# Altium project QUTMS_TSAL_V2.PrjPcb
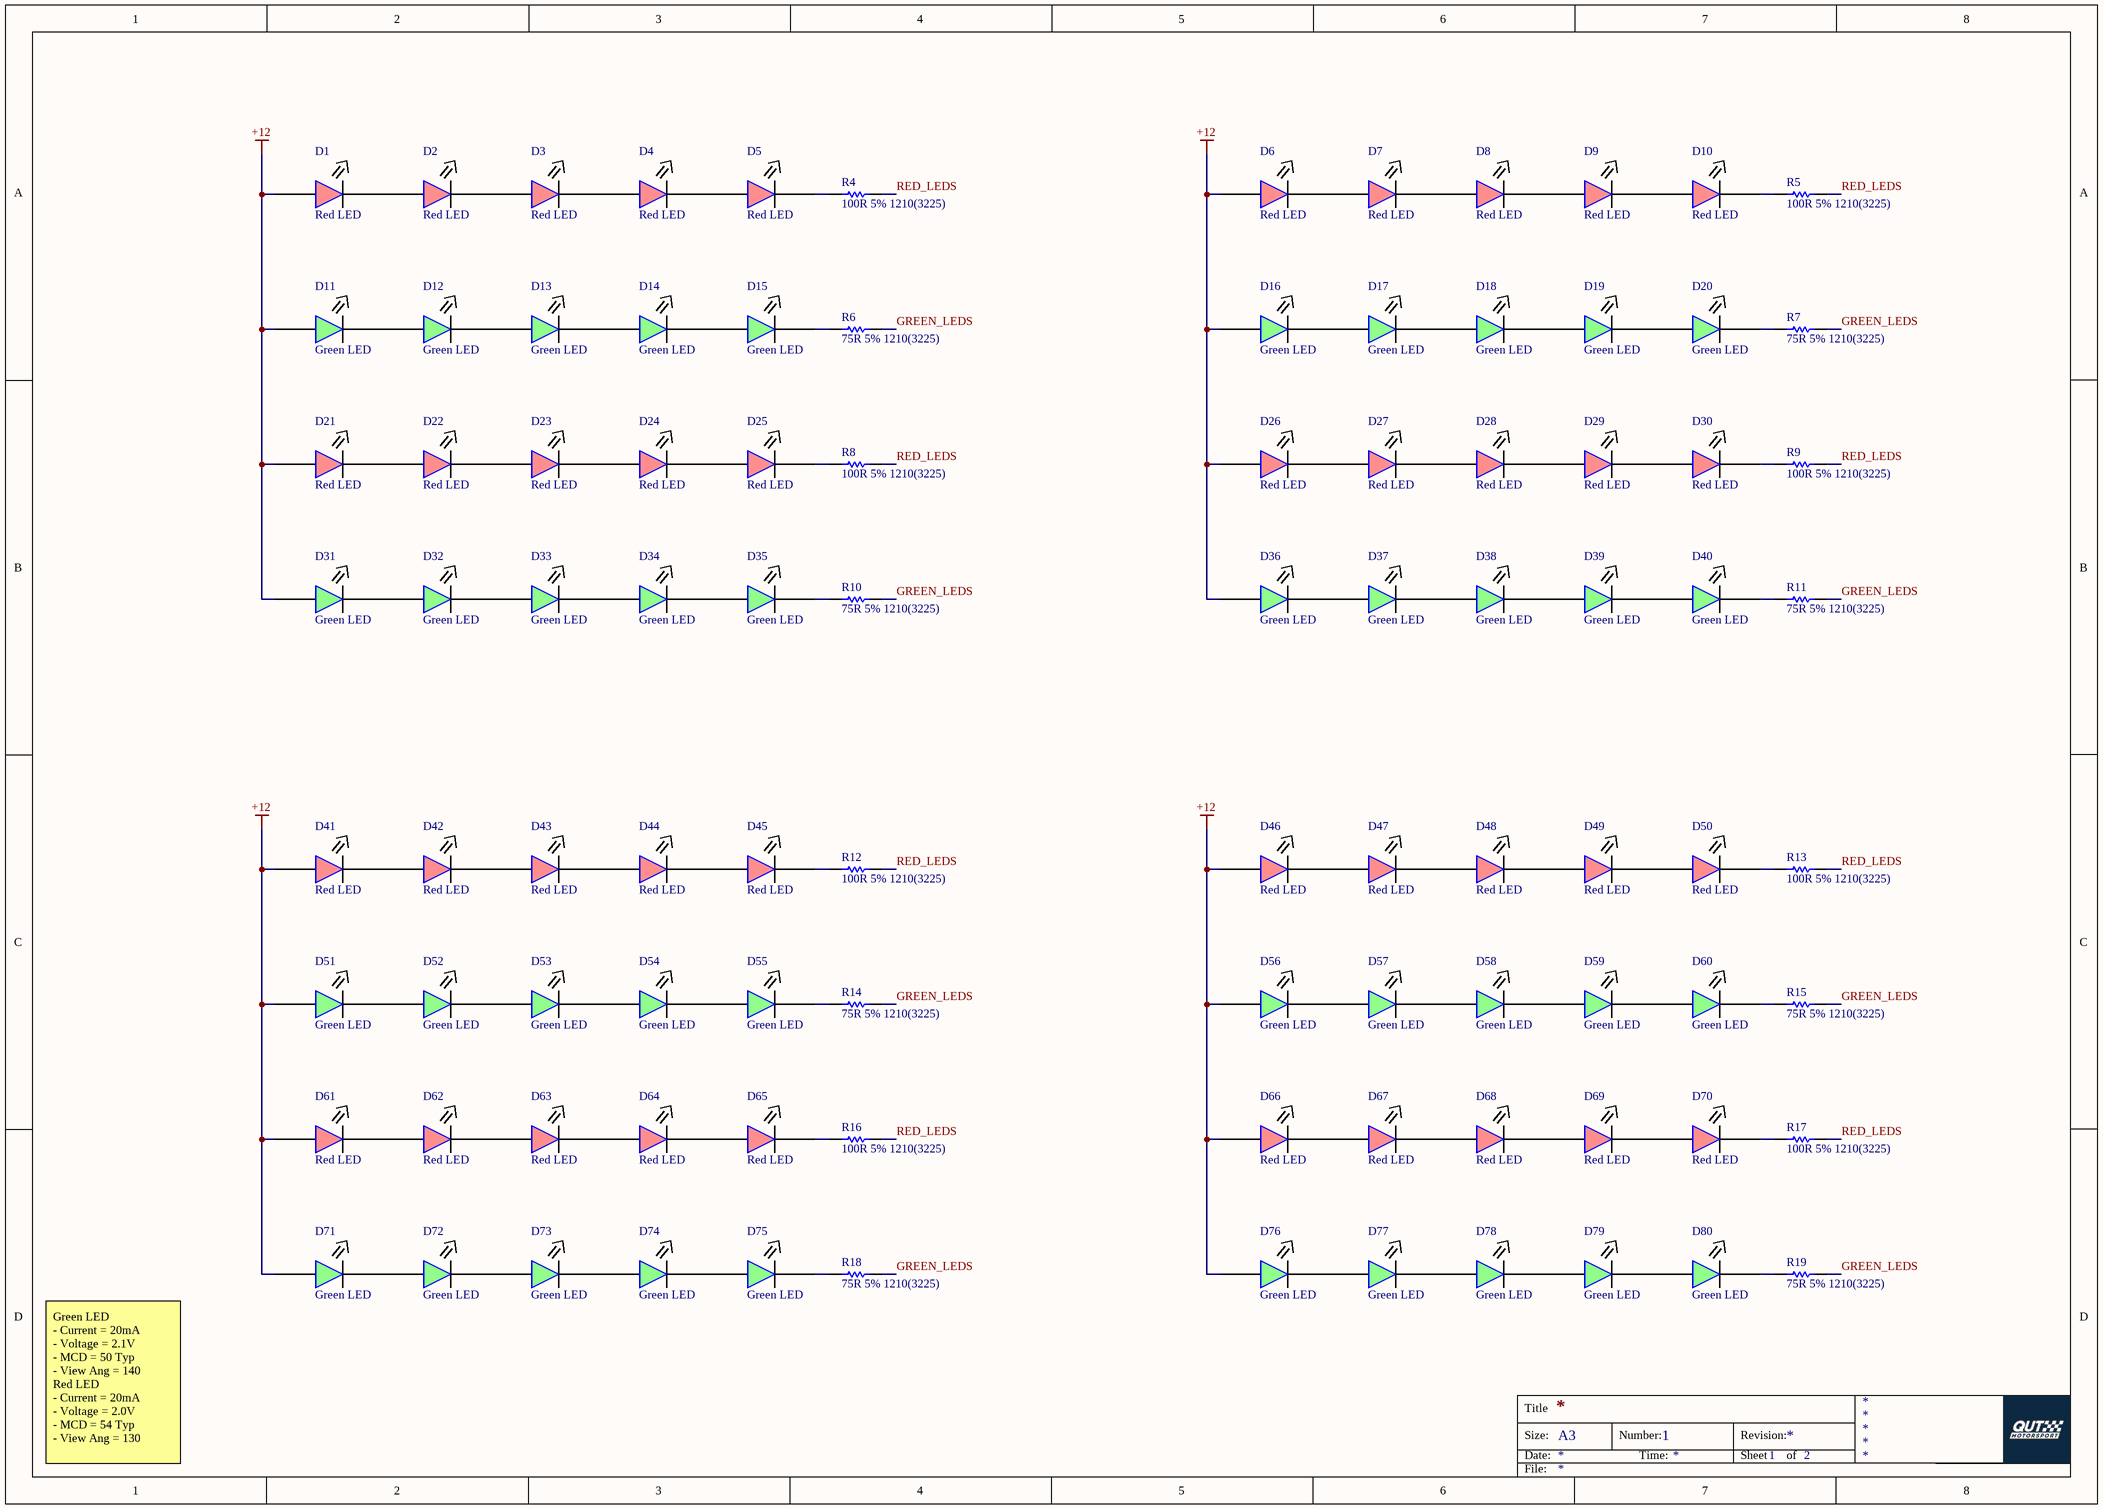
[diagram p0: LEDs.SchDoc]
2 sheets, 105 parts. Net scope: global (net labels, ports and power ports of the same name join across sheets).
Board file: TSAL.PcbDoc
Sheets:
  LEDs.SchDoc
  Control.SchDoc

## Sheet LEDs.SchDoc
size A3; DocumentNumber: 1; SheetNumber: 1; SheetTotal: 2

### Parts
D1  Red LED  [LED-0603]
D2  Red LED  [LED-0603]
D3  Red LED  [LED-0603]
D4  Red LED  [LED-0603]
D5  Red LED  [LED-0603]
D6  Red LED  [LED-0603]
D7  Red LED  [LED-0603]
D8  Red LED  [LED-0603]
D9  Red LED  [LED-0603]
D10  Red LED  [LED-0603]
D11  Green LED  [LED-0603]
D12  Green LED  [LED-0603]
D13  Green LED  [LED-0603]
D14  Green LED  [LED-0603]
D15  Green LED  [LED-0603]
D16  Green LED  [LED-0603]
D17  Green LED  [LED-0603]
D18  Green LED  [LED-0603]
D19  Green LED  [LED-0603]
D20  Green LED  [LED-0603]
D21  Red LED  [LED-0603]
D22  Red LED  [LED-0603]
D23  Red LED  [LED-0603]
D24  Red LED  [LED-0603]
D25  Red LED  [LED-0603]
D26  Red LED  [LED-0603]
D27  Red LED  [LED-0603]
D28  Red LED  [LED-0603]
D29  Red LED  [LED-0603]
D30  Red LED  [LED-0603]
D31  Green LED  [LED-0603]
D32  Green LED  [LED-0603]
D33  Green LED  [LED-0603]
D34  Green LED  [LED-0603]
D35  Green LED  [LED-0603]
D36  Green LED  [LED-0603]
D37  Green LED  [LED-0603]
D38  Green LED  [LED-0603]
D39  Green LED  [LED-0603]
D40  Green LED  [LED-0603]
D41  Red LED  [LED-0603]
D42  Red LED  [LED-0603]
D43  Red LED  [LED-0603]
D44  Red LED  [LED-0603]
D45  Red LED  [LED-0603]
D46  Red LED  [LED-0603]
D47  Red LED  [LED-0603]
D48  Red LED  [LED-0603]
D49  Red LED  [LED-0603]
D50  Red LED  [LED-0603]
D51  Green LED  [LED-0603]
D52  Green LED  [LED-0603]
D53  Green LED  [LED-0603]
D54  Green LED  [LED-0603]
D55  Green LED  [LED-0603]
D56  Green LED  [LED-0603]
D57  Green LED  [LED-0603]
D58  Green LED  [LED-0603]
D59  Green LED  [LED-0603]
D60  Green LED  [LED-0603]
D61  Red LED  [LED-0603]
D62  Red LED  [LED-0603]
D63  Red LED  [LED-0603]
D64  Red LED  [LED-0603]
D65  Red LED  [LED-0603]
D66  Red LED  [LED-0603]
D67  Red LED  [LED-0603]
D68  Red LED  [LED-0603]
D69  Red LED  [LED-0603]
D70  Red LED  [LED-0603]
D71  Green LED  [LED-0603]
D72  Green LED  [LED-0603]
D73  Green LED  [LED-0603]
D74  Green LED  [LED-0603]
D75  Green LED  [LED-0603]
D76  Green LED  [LED-0603]
D77  Green LED  [LED-0603]
D78  Green LED  [LED-0603]
D79  Green LED  [LED-0603]
D80  Green LED  [LED-0603]
R4  100R 5% 1210(3225)  [RESC1210(3225)_N]
R5  100R 5% 1210(3225)  [RESC1210(3225)_N]
R6  75R 5% 1210(3225)  [RESC1210(3225)_N]
R7  75R 5% 1210(3225)  [RESC1210(3225)_N]
R8  100R 5% 1210(3225)  [RESC1210(3225)_N]
R9  100R 5% 1210(3225)  [RESC1210(3225)_N]
R10  75R 5% 1210(3225)  [RESC1210(3225)_N]
R11  75R 5% 1210(3225)  [RESC1210(3225)_N]
R12  100R 5% 1210(3225)  [RESC1210(3225)_N]
R13  100R 5% 1210(3225)  [RESC1210(3225)_N]
R14  75R 5% 1210(3225)  [RESC1210(3225)_N]
R15  75R 5% 1210(3225)  [RESC1210(3225)_N]
R16  100R 5% 1210(3225)  [RESC1210(3225)_N]
R17  100R 5% 1210(3225)  [RESC1210(3225)_N]
R18  75R 5% 1210(3225)  [RESC1210(3225)_N]
R19  75R 5% 1210(3225)  [RESC1210(3225)_N]

### Nets
+12: D1.1 D6.1 D11.1 D16.1 D21.1 D26.1 D31.1 D36.1 D41.1 D46.1 D51.1 D56.1 D61.1 D66.1 D71.1 D76.1
GREEN_LEDS: R6.1 R7.1 R10.1 R11.1 R14.1 R15.1 R18.1 R19.1
RED_LEDS: R4.1 R5.1 R8.1 R9.1 R12.1 R13.1 R16.1 R17.1
NetD1_2: D1.2 D2.1
NetD2_2: D2.2 D3.1
NetD3_2: D3.2 D4.1
NetD4_2: D4.2 D5.1
NetD5_2: D5.2 R4.2
NetD6_2: D6.2 D7.1
NetD7_2: D7.2 D8.1
NetD8_2: D8.2 D9.1
NetD9_2: D9.2 D10.1
NetD10_2: D10.2 R5.2
NetD11_2: D11.2 D12.1
NetD12_2: D12.2 D13.1
NetD13_2: D13.2 D14.1
NetD14_2: D14.2 D15.1
NetD15_2: D15.2 R6.2
NetD16_2: D16.2 D17.1
NetD17_2: D17.2 D18.1
NetD18_2: D18.2 D19.1
NetD19_2: D19.2 D20.1
NetD20_2: D20.2 R7.2
NetD21_2: D21.2 D22.1
NetD22_2: D22.2 D23.1
NetD23_2: D23.2 D24.1
NetD24_2: D24.2 D25.1
NetD25_2: D25.2 R8.2
NetD26_2: D26.2 D27.1
NetD27_2: D27.2 D28.1
NetD28_2: D28.2 D29.1
NetD29_2: D29.2 D30.1
NetD30_2: D30.2 R9.2
NetD31_2: D31.2 D32.1
NetD32_2: D32.2 D33.1
NetD33_2: D33.2 D34.1
NetD34_2: D34.2 D35.1
NetD35_2: D35.2 R10.2
NetD36_2: D36.2 D37.1
NetD37_2: D37.2 D38.1
NetD38_2: D38.2 D39.1
NetD39_2: D39.2 D40.1
NetD40_2: D40.2 R11.2
NetD41_2: D41.2 D42.1
NetD42_2: D42.2 D43.1
NetD43_2: D43.2 D44.1
NetD44_2: D44.2 D45.1
NetD45_2: D45.2 R12.2
NetD46_2: D46.2 D47.1
NetD47_2: D47.2 D48.1
NetD48_2: D48.2 D49.1
NetD49_2: D49.2 D50.1
NetD50_2: D50.2 R13.2
NetD51_2: D51.2 D52.1
NetD52_2: D52.2 D53.1
NetD53_2: D53.2 D54.1
NetD54_2: D54.2 D55.1
NetD55_2: D55.2 R14.2
NetD56_2: D56.2 D57.1
NetD57_2: D57.2 D58.1
NetD58_2: D58.2 D59.1
NetD59_2: D59.2 D60.1
NetD60_2: D60.2 R15.2
NetD61_2: D61.2 D62.1
NetD62_2: D62.2 D63.1
NetD63_2: D63.2 D64.1
NetD64_2: D64.2 D65.1
NetD65_2: D65.2 R16.2
NetD66_2: D66.2 D67.1
NetD67_2: D67.2 D68.1
NetD68_2: D68.2 D69.1
NetD69_2: D69.2 D70.1
NetD70_2: D70.2 R17.2
NetD71_2: D71.2 D72.1
NetD72_2: D72.2 D73.1
NetD73_2: D73.2 D74.1
NetD74_2: D74.2 D75.1
NetD75_2: D75.2 R18.2
NetD76_2: D76.2 D77.1
NetD77_2: D77.2 D78.1
NetD78_2: D78.2 D79.1
NetD79_2: D79.2 D80.1
NetD80_2: D80.2 R19.2

### Notes on the sheet
- Green LED
  - Current = 20mA
  - Voltage = 2.1V
  - MCD = 50 Typ
  - View Ang = 140
  Red LED
  - Current = 20mA
  - Voltage = 2.0V
  - MCD = 54 Typ
  - View Ang = 130
- Title
- Size:
- Date:
- A3
- Number:
- Time:
- Revision:
- Sheet
- of
- File:

### Library data of the parts
D1-D10 D21-D30 D41-D50 D61-D70 = LEDRed
D11-D20 D31-D40 D51-D60 D71-D80 = LEDGreen
R4 R5 R8 R9 R12 R13 R16 R17 = CMP-1015-00050-1: 100R 0.5W 5% 1210 (3225 Metric)  SMD; Value: 100.00 Ohm; Case-Metric: 3225; Case-EIA: 1210; Power: 0.5 W; Tolerance: 5 %; Technology: SMT
R6 R7 R10 R11 R14 R15 R18 R19 = CMP-1015-00047-1: 75R 0.5W 5% 1210 (3225 Metric)  SMD; Value: 75.00 Ohm; Case-EIA: 1210; Case-Metric: 3225; Tolerance: 5 %; Power: 0.5 W; Technology: SMT

## Sheet Control.SchDoc
size A4; DocumentNumber: 2; SheetNumber: 2; SheetTotal: 2
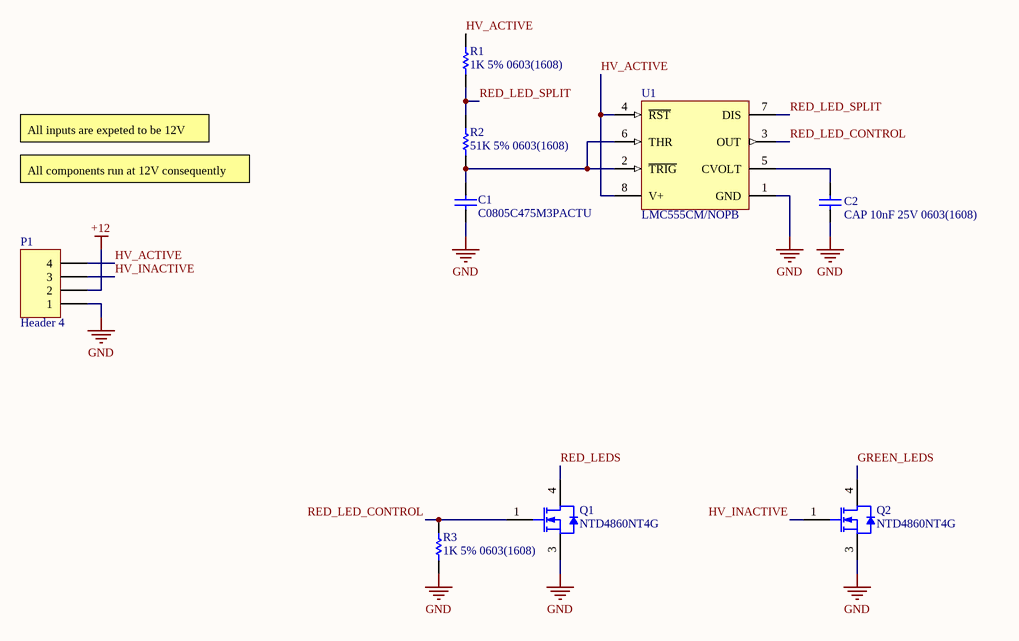
[diagram p1: Control.SchDoc]

### Parts
C1  C0805C475M3PACTU  [CAPC2013X145X50NL20T25]
C2  CAP 10nF 25V 0603(1608)  [CAPC0603(1608)100_M]
P1  Header 4  [HDR1X4]
Q1  NTD4860NT4G  [ONSC-DPAK-3-369AA-01_V]
Q2  NTD4860NT4G  [ONSC-DPAK-3-369AA-01_V]
R1  1K 5% 0603(1608)  [RESC0603(1608)_L]
R2  51K 5% 0603(1608)  [RESC0603(1608)_M]
R3  1K 5% 0603(1608)  [RESC0603(1608)_L]
U1  LMC555CM/NOPB  [D0008A_L]

### Nets
+12: P1.2
GND: C1.1 C2.1 P1.1 Q1.3(S) Q2.3(S) R3.1 U1.1(GND)
GREEN_LEDS: Q2.4(D)
HV_ACTIVE: P1.4 R1.2 U1.4(~{RST}) U1.8(V+)
HV_INACTIVE: P1.3 Q2.1(G)
RED_LED_CONTROL: Q1.1(G) R3.2 U1.3(OUT)
RED_LED_SPLIT: R1.1 R2.2 U1.7(DIS)
RED_LEDS: Q1.4(D)
NetC1_2: C1.2 R2.1 U1.2(~{TRIG}) U1.6(THR)
NetC2_2: C2.2 U1.5(CVOLT)

### Notes on the sheet
- All inputs are expeted to be 12V
- All components run at 12V consequently

### Library data of the parts
C1 = CMP-2007-01014-1: Manufacturer: Kemet; Part Number: C0805C475M3PACTU
C2 = CMP-1035-02316-1: CAP 10nF 25V ±5% 0603 (1608 Metric) Thickness 1mm SMD; Tolerance: Â±5%; Case-EIA: 0603; Case-Metric: 1608; Rated Voltage: 25 V; Technology: SMT; Max Thickness: 1 mm; Value: 10nF
P1 = Header 4: Header, 4-Pin; LatestRevisionDate: 17-Jul-2002; LatestRevisionNote: Re-released for DXP Platform.; Publisher: Altium Limited
Q1 Q2 = CMP-1058-00321-1: Power MOSFET, 25 V, 65 A, Single N-Channel, 3-Pin DPAK, Pb-Free, Tape and Reel; Manufacturer: On Semiconductor; VGS Max (V): 20; Ciss Typ (pF): 1308; Coss Typ (pF): 342; Qrr Typ (nC): 3.5; VGS(th) Max (V): 2.5; Channel Polarity: N Channel; V(BR)DSS Min (V): 25; ID Max (A): 65; Crss Typ (pF): 169; ComponentLink1Description: Manufacturer URL; Configuration: Single; ComponentLink2Description: Datasheet; DatasheetVersion: Rev. 1; PackageDescription: 3-Pin Flange Mount, Body 6.54 x 6.095 mm, Pitch 2.29 mm; PartNumber: NTD4860NT4G; Packing: Tape and Reel; ComponentLink3URL: http://www.onsemi.cn/pub_link/Collateral/369AA.PDF; Package Type: DPAK-3; PackageReference: DPAK-3-369AA-01; ComponentLink2URL: http://www.onsemi.cn/pub_link/Collateral/NTD4860N.PDF; Mounting Technology: Surface Mount; RoHS: Pb-Free; ComponentLink1URL: http://www.onsemi.com/; PackageVersion: Rev. B, 06/2010; ComponentLink3Description: Package Specification
R1 R3 = CMP-1012-00074-1: 1K 0.1W 5% 0603 (1608 Metric)  SMD; Case-EIA: 0603; Case-Metric: 1608; Value: 1000.00 Ohm; Technology: SMT; Tolerance: 5 %; Power: 0.1 W
R2 = CMP-1012-00115-1: 51K 0.1W 5% 0603 (1608 Metric)  SMD; Case-EIA: 0603; Case-Metric: 1608; Value: 51000.00 Ohm; Power: 0.1 W; Technology: SMT; Tolerance: 5 %
U1 = CMP-0056-00124-3: CMOS Timer, 8-pin Narrow SOIC, Pb-Free; Manufacturer: Texas Instruments; PackageTopMarking: NSZXTT*LMC*555CM; PowerWise: N; CompType: Analog IC; RoHS: Y; ComponentLink1Description: Datasheet URL; ComponentLink1URL: http://www.ti.com/general/docs/lit/getliterature.tsp?genericPartNumber=LMC555&fileType=pdf; Code_JEDEC: MS-012-AA; PackageDescription: SOIC Narrow, 4.9 x 3.9 x 1.45mm, 8 Lead, 1.27mm Pitch; Code_IPC: SOIC127P600-8; PinCount: 8; PackageReference: D0008A

## Nets that join several sheets
+12: LEDs (16 pins), Control (P1.2)
GREEN_LEDS: LEDs (8 pins), Control (Q2.4)
RED_LEDS: LEDs (8 pins), Control (Q1.4)